# Altium schematic sheet STM32.SchDoc
size A4
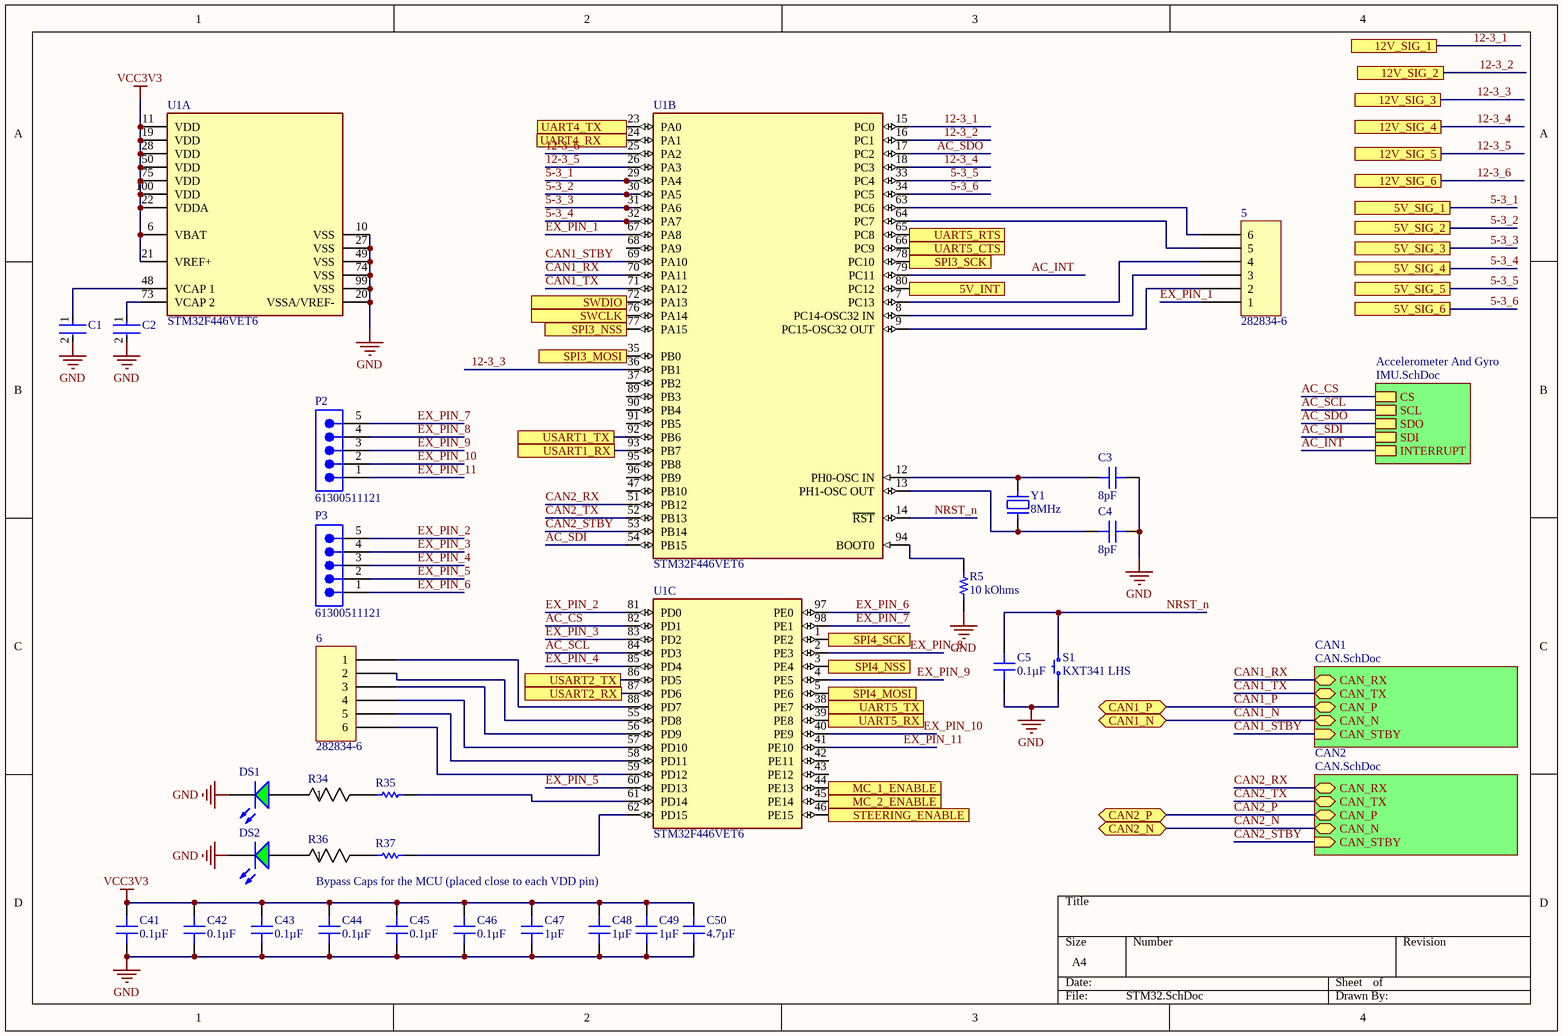
[diagram p0: STM32.SchDoc]

## Parts
5  282834-6  [TE 282834-6]
6  282834-6  [TE 282834-6]
C1  GRM188R71A225KE15D  [FP-GRM188-0_1-e0_2_0_5-MFG]  (value not drawn)
C2  GRM188R71A225KE15D  [FP-GRM188-0_1-e0_2_0_5-MFG]  (value not drawn)
C3  8pF  [CAP 0402_1005]
C4  8pF  [CAP 0402_1005]
C5  0.1µF  [CAP 0402_1005]
C41  0.1µF  [CAP 0402_1005]
C42  0.1µF  [CAP 0402_1005]
C43  0.1µF  [CAP 0402_1005]
C44  0.1µF  [CAP 0402_1005]
C45  0.1µF  [CAP 0402_1005]
C46  0.1µF  [CAP 0402_1005]
C47  1µF  [CAP 0402_1005]
C48  1µF  [CAP 0402_1005]
C49  1µF  [CAP 0402_1005]
C50  4.7µF  [CAP 0402_1005]
DS1  HLMP-4740  [AVAG-HLMP-4740]  (value not drawn)
DS2  HLMP-4740  [AVAG-HLMP-4740]  (value not drawn)
P2  61300511121  [61300511121]
P3  61300511121  [61300511121]
R5  10 kOhms  [RES 0402_1005]
R34  AC01000005000JA100  [RES_AC01_VIS]  (value not drawn)
R35  RC0805FR-071KL  [RESC2013X60X35ML10T20]  (value not drawn)
R36  AC01000005000JA100  [RES_AC01_VIS]  (value not drawn)
R37  RC0805FR-071KL  [RESC2013X60X35ML10T20]  (value not drawn)
S1  KXT341 LHS  [C&K KXT3]
U1  STM32F446VET6  [FP-LQFP100-1L-MFG]  (parts A,B,C of 3)
Y1  8MHz  [NDK NX3225GD]

## Sub-sheets
Accelerometer And Gyro = IMU.SchDoc: CS, SCL, SDO, SDI, INTERRUPT
CAN1 = CAN.SchDoc: CAN_RX (bidir), CAN_TX (bidir), CAN_STBY (in), CAN_P (bidir), CAN_N (bidir)
CAN2 = CAN.SchDoc: CAN_RX (bidir), CAN_TX (bidir), CAN_STBY (in), CAN_P (bidir), CAN_N (bidir)

## Ports
5V_INT, 5V_SIG_1, 5V_SIG_2, 5V_SIG_3, 5V_SIG_4, 5V_SIG_5, 5V_SIG_6, 12V_SIG_1, 12V_SIG_2, 12V_SIG_3, 12V_SIG_4, 12V_SIG_5, 12V_SIG_6, CAN1_N (bidir), CAN1_P (bidir), CAN2_N (bidir), CAN2_P (bidir), MC_1_ENABLE, MC_2_ENABLE, SPI3_MOSI, SPI3_NSS, SPI3_SCK, SPI4_MOSI, SPI4_NSS, SPI4_SCK, STEERING_ENABLE, SWCLK, SWDIO, UART4_RX, UART4_TX, UART5_CTS, UART5_RTS, UART5_RX, UART5_TX, USART1_RX, USART1_TX, USART2_RX, USART2_TX

## Nets
GND: C1.2 C2.2 C3.2 C4.2 C5.1 C41.1 C42.1 C43.1 C44.1 C45.1 C46.1 C47.1 C48.1 C49.1 C50.1 DS1.2(K) DS2.2(K) R5.1 S1.1 U1.10(VSS) U1.20(VSSA/VREF-) U1.27(VSS) U1.49(VSS) U1.74(VSS) U1.99(VSS)
VCC3V3: C41.2 C42.2 C43.2 C44.2 C45.2 C46.2 C47.2 C48.2 C49.2 C50.2 U1.6(VBAT) U1.11(VDD) U1.19(VDD) U1.21(VREF+) U1.22(VDDA) U1.28(VDD) U1.50(VDD) U1.75(VDD) U1.100(VDD)
5-3_1: U1.29(PA4) ; port 5V_SIG_1
5-3_2: U1.30(PA5) ; port 5V_SIG_2
5-3_3: U1.31(PA6) ; port 5V_SIG_3
5-3_4: U1.32(PA7) ; port 5V_SIG_4
5-3_5: U1.33(PC4) ; port 5V_SIG_5
5-3_6: U1.34(PC5) ; port 5V_SIG_6
5V_INT: U1.80(PC12) ; port 5V_INT
12-3_1: U1.15(PC0) ; port 12V_SIG_1
12-3_2: U1.16(PC1) ; port 12V_SIG_2
12-3_3: U1.36(PB1) ; port 12V_SIG_3
12-3_4: U1.18(PC3) ; port 12V_SIG_4
12-3_5: U1.26(PA3) ; port 12V_SIG_5
12-3_6: U1.25(PA2) ; port 12V_SIG_6
AC_CS: U1.82(PD1) ; sheet Accelerometer And Gyro/CS
AC_INT: U1.79(PC11) ; sheet Accelerometer And Gyro/INTERRUPT
AC_SCL: U1.84(PD3) ; sheet Accelerometer And Gyro/SCL
AC_SDI: U1.54(PB15) ; sheet Accelerometer And Gyro/SDI
AC_SDO: U1.17(PC2) ; sheet Accelerometer And Gyro/SDO
CAN1_N: port CAN1_N, sheet CAN1/CAN_N
CAN1_P: port CAN1_P, sheet CAN1/CAN_P
CAN1_RX: U1.70(PA11) ; sheet CAN1/CAN_RX
CAN1_STBY: U1.69(PA10) ; sheet CAN1/CAN_STBY
CAN1_TX: U1.71(PA12) ; sheet CAN1/CAN_TX
CAN2_N: port CAN2_N, sheet CAN2/CAN_N
CAN2_P: port CAN2_P, sheet CAN2/CAN_P
CAN2_RX: U1.51(PB12) ; sheet CAN2/CAN_RX
CAN2_STBY: U1.53(PB14) ; sheet CAN2/CAN_STBY
CAN2_TX: U1.52(PB13) ; sheet CAN2/CAN_TX
EX_PIN_1: 5.1 U1.67(PA8)
EX_PIN_2: P3.5 U1.81(PD0)
EX_PIN_3: P3.4 U1.83(PD2)
EX_PIN_4: P3.3 U1.85(PD4)
EX_PIN_5: P3.2 U1.60(PD13)
EX_PIN_6: P3.1 U1.97(PE0)
EX_PIN_7: P2.5 U1.98(PE1)
EX_PIN_8: P2.4 U1.2(PE3)
EX_PIN_9: P2.3 U1.4(PE5)
EX_PIN_10: P2.2 U1.40(PE9)
EX_PIN_11: P2.1 U1.41(PE10)
MC_1_ENABLE: U1.44(PE13) ; port MC_1_ENABLE
MC_2_ENABLE: U1.45(PE14) ; port MC_2_ENABLE
NRST_n: C5.2 S1.2 U1.14(~{RST})
SPI3_MOSI: U1.35(PB0) ; port SPI3_MOSI
SPI3_NSS: U1.77(PA15) ; port SPI3_NSS
SPI3_SCK: U1.78(PC10) ; port SPI3_SCK
SPI4_MOSI: U1.5(PE6) ; port SPI4_MOSI
SPI4_NSS: U1.3(PE4) ; port SPI4_NSS
SPI4_SCK: U1.1(PE2) ; port SPI4_SCK
STEERING_ENABLE: U1.46(PE15) ; port STEERING_ENABLE
SWCLK: U1.76(PA14) ; port SWCLK
SWDIO: U1.72(PA13) ; port SWDIO
UART4_RX: U1.24(PA1) ; port UART4_RX
UART4_TX: U1.23(PA0) ; port UART4_TX
UART5_CTS: U1.66(PC9) ; port UART5_CTS
UART5_RTS: U1.65(PC8) ; port UART5_RTS
UART5_RX: U1.39(PE8) ; port UART5_RX
UART5_TX: U1.38(PE7) ; port UART5_TX
USART1_RX: U1.93(PB7) ; port USART1_RX
USART1_TX: U1.92(PB6) ; port USART1_TX
USART2_RX: U1.87(PD6) ; port USART2_RX
USART2_TX: U1.86(PD5) ; port USART2_TX
Net5_2: 5.2 U1.9(PC15-OSC32_OUT)
Net5_3: 5.3 U1.8(PC14-OSC32_IN)
Net5_4: 5.4 U1.7(PC13)
Net5_5: 5.5 U1.64(PC7)
Net5_6: 5.6 U1.63(PC6)
Net6_1: 6.1 U1.88(PD7)
Net6_2: 6.2 U1.55(PD8)
Net6_3: 6.3 U1.56(PD9)
Net6_4: 6.4 U1.57(PD10)
Net6_5: 6.5 U1.58(PD11)
Net6_6: 6.6 U1.59(PD12)
NetC1_1: C1.1 U1.48(VCAP_1)
NetC2_1: C2.1 U1.73(VCAP_2)
NetC3_1: C3.1 U1.12(PH0-OSC_IN) Y1.2
NetC4_1: C4.1 U1.13(PH1-OSC_OUT) Y1.1
NetDS1_1: DS1.1(A) R34.1
NetDS2_1: DS2.1(A) R36.1
NetR5_2: R5.2 U1.94(BOOT0)
NetR34_2: R34.2 R35.1
NetR35_2: R35.2 U1.61(PD14)
NetR36_2: R36.2 R37.1
NetR37_2: R37.2 U1.62(PD15)

Not connected (* = marked no-connect by the designer): U1 37(PB2) 42(PE11) 43(PE12) 47(PB10) 68(PA9) 89(PB3) 90(PB4) 91(PB5) 95(PB8) 96(PB9)

## Notes on the sheet
- Bypass Caps for the MCU (placed close to each VDD pin)

## Library data of the parts
5 6 = 282834-6: TERM BLK 6P SIDE ENT 2.54MM PCB; Manufacturer: TE Connectivity AMP Connectors; Current: 10A; Mating Orientation: Horizontal with Board; Number of Levels: 1; Pitch: 0.100" (2.54mm); Positions Per Level: 6; Voltage: 150V; Wire Gauge: 16-30 AWG; Wire Termination: Screw - Rising Cage Clamp; Part Number: 282834-6; Color: Green; ComponentLink1Description: Datasheet; ComponentLink1URL: https://www.te.com/commerce/DocumentDelivery/DDEController?Action=srchrtrv&DocNm=282834&DocType=Customer+Drawing&DocLang=English; ComponentLink2Description: DigiKey Link; ComponentLink2URL: http://digikey.com/product-detail/en/te-connectivity-amp-connectors/282834-6/A98337-ND/1153267; LastUpdated: 2020-01-15 4:16:31 AM; Lifecycle Status: Active; Minimum Order: 1; Mounting Type: Through Hole; Packaging: Bulk; Part Status: Active; Price: 4.72; Series: Buchanan; Supplier 1: DigiKey; Supplier Part Number 1: A98337-ND
C1 C2 = CMP-2006-02836-2: Chip Multilayer Ceramic Capacitors for General Purpose, 0603, 2.2uF, X7R, 15%, 10%, 10V; Case Code (Metric): 1608; Height: 0.8mm; Packaging: Cut Tape; Voltage: 10V; Lead Free: Lead Free; Min Operating Temperature: -55°C; Voltage Rating (DC): 10V; Max Operating Temperature: 125°C; Voltage Rating: 10V; Dielectric: X7R; Depth: 0.8mm; Case Code (Imperial): 0603; Termination: SMD/SMT; Case/Package: 0603; Number of Pins: 2; REACH SVHC: No SVHC; Mount: Surface Mount; Width: 0.031inch; Material: Ceramic; Capacitance: 2.2uF; Package Quantity: 1; Weight: 7.1E-05oz; Length: 1.6mm; Thickness: 0.035inch; Tolerance: 10%
C3 C4 = C1005NP01H080D050BA: CAP CER 8PF 50V NP0 0402; Manufacturer: TDK Corporation; Temperature Coefficient: C0G, NP0; Tolerance: ±0.5pF; Part Number: C1005NP01H080D050BA; Value: 8pF; Applications: General Purpose; Capacitance: 8pF; ComponentLink1Description: Datasheet; ComponentLink1URL: https://product.tdk.com/info/en/catalog/datasheets/mlcc_commercial_hightemp_en.pdf?ref_disty=digikey; ComponentLink2Description: DigiKey Link; ComponentLink2URL: http://digikey.com/product-detail/en/tdk-corporation/C1005NP01H080D050BA/445-13781-1-ND/3955447; Device Package: 0402 (1005 Metric); Features: High Temperature; LastUpdated: 2020-09-02 1:02:24 AM; Lifecycle Status: Active; Minimum Order: 1; Mounting Type: Surface Mount, MLCC; Operating Temperature: -55°C ~ 150°C; Package / Case: 0402 (1005 Metric); Packaging: TapeAndReel; PartId: 2033; Part Status: Active; Price: 0.01; Series: C; Size / Dimension: 0.039" L x 0.020" W (1.00mm x 0.50mm); Supplier 1: DigiKey; Supplier Part Number 1: 445-13781-1-ND; Thickness (Max): 0.022" (0.55mm); Voltage - Rated: 50V
C5 C41-C46 = C0402C104K4RECAUTO: CAP CER 0402 0.1UF 16V X7R 10%; Manufacturer: KEMET; Part Number: C0402C104K4RECAUTO; Value: 0.1µF; Applications: Automotive, ESD Protection; Capacitance: 0.1µF; ComponentLink1Description: Datasheet; ComponentLink1URL: https://api.kemet.com/component-edge/download/datasheet/C0402C104K4RECAUTO.pdf; ComponentLink2Description: DigiKey Link; ComponentLink2URL: http://digikey.com/product-detail/en/kemet/C0402C104K4RECAUTO/399-17167-1-ND/8563708; Device Package: 0402 (1005 Metric); LastUpdated: 2020-09-02 1:02:25 AM; Lifecycle Status: Active; Minimum Order: 1; Mounting Type: Surface Mount, MLCC; Operating Temperature: -55°C ~ 125°C; Package / Case: 0402 (1005 Metric); Packaging: TapeAndReel; PartId: 1731; Part Status: Active; Price: 0.02; Series: ESD SMD Auto X7R; Size / Dimension: 0.039" L x 0.020" W (1.00mm x 0.50mm); Supplier 1: DigiKey; Supplier Part Number 1: 399-17167-1-ND; Temperature Coefficient: X7R; Thickness (Max): 0.022" (0.55mm); Tolerance: ±10%; Voltage - Rated: 16V; Ratings: AEC-Q200
C47-C49 = CGB2A1X5R1A105K033BC: CAP CER 1UF 10V X5R 0402; Manufacturer: TDK Corporation; Tolerance: ±10%; Part Number: CGB2A1X5R1A105K033BC; Value: 1µF; Applications: General Purpose; Capacitance: 1µF; ComponentLink1Description: Datasheet; ComponentLink1URL: https://product.tdk.com/info/en/catalog/datasheets/mlcc_commercial_lowprofile_en.pdf?ref_disty=digikey; ComponentLink2Description: DigiKey Link; ComponentLink2URL: http://digikey.com/product-detail/en/tdk-corporation/CGB2A1X5R1A105K033BC/445-13179-1-ND/3954845; Device Package: 0402 (1005 Metric); LastUpdated: 2020-09-02 1:02:25 AM; Lifecycle Status: Active; Minimum Order: 1; Mounting Type: Surface Mount, MLCC; Operating Temperature: -55°C ~ 85°C; Package / Case: 0402 (1005 Metric); Packaging: TapeAndReel; PartId: 1796; Part Status: Active; Price: 0.02; Series: CGB; Size / Dimension: 0.039" L x 0.020" W (1.00mm x 0.50mm); Supplier 1: DigiKey; Supplier Part Number 1: 445-13179-1-ND; Temperature Coefficient: X5R; Thickness (Max): 0.013" (0.33mm); Voltage - Rated: 10V; Features: Low Profile
C50 = C1005X5R1A475K050BC: CAP CER 4.7UF 10V X5R 0402; Manufacturer: TDK Corporation; Tolerance: ±10%; Part Number: C1005X5R1A475K050BC; Value: 4.7µF; Applications: General Purpose; Capacitance: 4.7µF; ComponentLink1Description: Datasheet; ComponentLink1URL: https://product.tdk.com/info/en/catalog/datasheets/mlcc_commercial_general_en.pdf?ref_disty=digikey; ComponentLink2Description: DigiKey Link; ComponentLink2URL: http://digikey.com/product-detail/en/tdk-corporation/C1005X5R1A475K050BC/445-13820-1-ND/3955486; Device Package: 0402 (1005 Metric); LastUpdated: 2020-09-02 1:02:25 AM; Lifecycle Status: Active; Minimum Order: 1; Mounting Type: Surface Mount, MLCC; Operating Temperature: -55°C ~ 85°C; Package / Case: 0402 (1005 Metric); Packaging: TapeAndReel; PartId: 1759; Part Status: Active; Price: 0.10; Series: C; Size / Dimension: 0.039" L x 0.020" W (1.00mm x 0.50mm); Supplier 1: DigiKey; Supplier Part Number 1: 445-13820-1-ND; Temperature Coefficient: X5R; Thickness (Max): 0.022" (0.55mm); Voltage - Rated: 10V; Features: Low ESL
DS1 DS2 = CMP-2000-06413-1: T-1 3/4 (5 mm) Low Current LED Lamp, Green, 1.9 V, -20 to 100 degC, 2-Pin THD, RoHS, Bulk; Manufacturer: AvagoTechnologies; Type: Uni-Color; Peak Wavelength: 565nm; Rad Hard: No; Viewing Angle: 50°; Dominant Wavelength/Color Temperature: 569nm; Number of LEDs: 1; Lens Appearance: ColoredDiffused; Lens Shape Type: Circular; Mounting Orientation: TopMount; Intensity: 2.3mcd; Datasheet Version: 07/2014; Category: LEDs; Datasheet URL: http://docs.avagotech.com/docs/AV02-1557EN; Packaging: Bulk; Pin Count: 2; Mounting Technology: ThroughHole; Package Reference: HLMP-4740; Mounting: ThroughHole; Manufacturer URL: http://www.avagotech.com/; Color: Green; Package: 2T-13/4; Package Description: 2-Pin Through Hole Device, Dia 5.845 mm, Pitch 2.54 mm
P2 P3 = CMP-1502-01068-2: NexarPartId: 32855526; Operating Supply Voltage: 250V; Number of Contacts: 5; Connector Type: Male Pin; Current Rating: 3A; Contact Resistance: 20mΩ; Pitch: 2.54mm; Gender: Male; Termination: Solder; RoHS: Compliant; Lead Pitch: 2.54mm; Contact Mating Length: 5.9944mm; Number of Positions: 5; Lead Free: Lead Free; Contact Plating: Gold; Number of Pins: 5; Min Operating Temperature: -40°C; Voltage Rating: 250V; Color: Black; Mount: Through Hole; REACH SVHC: Unknown; Packaging: Bulk; Height: 8.89mm; Number of Rows: 1; Orientation: Vertical; Contact Material: Copper; Max Operating Temperature: 105°C
R5 = CRCW040210K0DHEDP: RES SMD 10K OHM 0.5% 1/16W 0402; Manufacturer: Vishay Dale; Power (Watts): 0.063W, 1/16W; Temperature Coefficient: ±50ppm/°C; Part Number: CRCW040210K0DHEDP; Value: 10 kOhms; ComponentLink1Description: Datasheet; ComponentLink1URL: http://www.vishay.com/docs/20036/dcrcwpe3.pdf; ComponentLink2Description: DigiKey Link; ComponentLink2URL: http://digikey.com/product-detail/en/vishay-dale/CRCW040210K0DHEDP/541-10KAVCT-ND/3593906; Composition: Thick Film; Device Package: 0402 (1005 Metric); Height - Seated (Max): 0.016" (0.40mm); LastUpdated: 2020-09-02 1:08:05 AM; Lifecycle Status: Active; Minimum Order: 1; Number of Terminations: 2; Operating Temperature: -55°C ~ 155°C; Package / Case: 0402 (1005 Metric); Packaging: TapeAndReel; PartId: 5057; Part Status: Active; Price: 0.03; Resistance: 10 kOhms; Series: CRCW-P; Size / Dimension: 0.039" L x 0.020" W (1.00mm x 0.50mm); Supplier 1: DigiKey; Supplier Part Number 1: 541-10KAVCT-ND; Supplier Device Package: 0402; Tolerance: ±0.5%; Features: Automotive AEC-Q200; Ratings: AEC-Q200
R34 R36 = CMP-00030-39746512-1: AC01000005000JA100 Res Wirewound 500 Ohm 5% 1W 100ppm/°C to 180ppm/°C Conformal AXL Thru-Hole Ammo Pack; Voltage Rating (DC): 22V; Lead Diameter: 800µm; Resistance: 500Ω; Weight: 519.986953mg; Number of Pins: 2; Min Operating Temperature: -40°C; Case/Package: Axial; Schedule B: 8533210080, 8533210080; Features: Flame Retardant Coating; Power Rating: 1W; Max Power Dissipation: 1W; Packaging: Tape & Box (TB); RoHS: Compliant; REACH SVHC: Unknown; NexarPartId: 39746512; Temperature Coefficient: 180ppm/°C; Diameter: 4.3mm; Contact Plating: Tin; Radiation Hardening: No; Max Operating Temperature: 275°C; Length: 11mm; Tolerance: 5%; Composition: Wirewound; Number of Terminations: 2; Termination: Axial; Voltage Rating: 22V
R35 R37 = CMP-2100-03671-1: Chip Resistor, 1 KOhm, +/- 1%, 125 mW, -55 to 155 degC, 0805 (2012 Metric), RoHS, Tape and Reel; Manufacturer: Yageo; Temperature Coefficient: 100ppm/degreesC; Voltage Rating (DC): 150V; Max Power Dissipation: 125mW; Resistance: 1KOhm; Number of Pins: 2; Number of Terminations: 2; Datasheet URL: http://www.yageo.com/NewPortal/yageodocoutput?fileName=/pdf/R-Chip/PYu-RC_Group_51_RoHS_L_5.pdf; Length: 0.079inch; Package Description: 2-Pin Surface Mounted Device, Body 2 x 1.25 mm; Depth: 1.25mm; Height: 0.024inch; Military Standard: Not; Case/Package: 0805; Package Reference: 0805; RoHSCompliant: true; Lead Free: LeadFree; Packaging: TapeandReel; Package Quantity: 1; Datasheet Version: Rev. 5, 10/2016; Tolerance: 1%; Min Operating Temperature: -55degC; Voltage Rating: 150V; Composition: ThickFilm; Case Code (Imperial): 0805; Power Rating: 125mW; Width: 0.049inch; Case Code (Metric): 2012; Manufacturer URL: http://www.yageo.com/; Max Operating Temperature: 155degC; REACH SVHC: Unknown; Termination: SMD/SMT
S1 = KXT341 LHS: SWITCH TACTILE SPST-NO 0.02A 15V; Manufacturer: C&K; Actuator Height off PCB, Vertical: 0.60mm; Actuator Orientation: Top Actuated; Actuator Type: Standard; Contact Rating @ Voltage: 0.02A @ 15VDC; Illumination: Non-Illuminated; Operating Force: 330gf; Outline: 3.00mm x 2.00mm; Switch Function: Off-Mom; Part Number: KXT341 LHS; Circuit: SPST-NO; ComponentLink1Description: Datasheet; ComponentLink1URL: https://dznh3ojzb2azq.cloudfront.net/products/Tactile/KXT3/documents/datasheet.pdf; ComponentLink2Description: DigiKey Link; ComponentLink2URL: http://digikey.com/product-detail/en/c-k/KXT341-LHS/CKN10781CT-ND/6607324; LastUpdated: 2020-09-02 1:27:07 AM; Lifecycle Status: Active; Minimum Order: 1; Mounting Type: Surface Mount; Operating Temperature: -40°C ~ 85°C; Packaging: TapeAndReel; Part Status: Active; Price: 0.14; Series: KXT3; Supplier 1: DigiKey; Supplier Part Number 1: CKN10781CT-ND; Termination Style: SMD (SMT) Tab
U1 = CMP-12105-000075-1: IC MCU 32BIT 512KB FLASH 100LQFP; Manufacturer: STMicroelectronics; Ram Size: 128KBytes; Data Bus Width: 32bits; Max Junction Temp: +125°C; Number Of Adc Channels: 16; Max Supply Voltage: 3.6V; Nominal Supply Current: 1.4-86mA; Number Of Uart Channels: 6; Core Architecture: ARM Cortex-M4; Standoff Height: 0.05mm; Number Of A/D Converters: 3; Frequency: 180MHz; Number Of Cores: 1; Min Supply Voltage: 1.65V; Number Of Timers/Counters: 14; Number Of Usb Channels: 2; Number Of Spi Channels: 4; Interface: I2C,SPI,UART,USART,Parallel,CAN,USB,LIN,IrDA,I2S,Other; Memory Size: 512KBytes; Number Of I/Os: 81; Ambient Temperature Range High: +85°C; Mouser Description: ARM Microcontrollers - MCU High-performance and DSP with FPU, ARM Cortex-M4 MCU with 512 Kbytes Flash, 180 MHz CPU, Art Accelerator, SDRAM; Device Class L2: Embedded Processors and Controllers; Temperature Range Low: -40°C; Device Class L1: Integrated Circuits (ICs); RoHS: TRUE; Ipc Land Pattern Name: QFP50P1600X1600X160-100; Manufacturer Part Number: STM32F446VET6; Octopart: https://octopart.com/stm32f446vet6-stmicroelectronics-52642922; Package: LQFP100-1L; Automotive: No; Category: IC; ComponentLink2URL: https://www.st.com/resource/en/datasheet/stm32f446ve.pdf; Digikey Description: IC MCU 32BIT 512KB FLASH 100LQFP; Temperature Range High: +85°C; Memory Type: FLASH; Lead Free: Yes; Height: 1.6mm; ComponentLink2Description: Datasheet; Number Of I2C Channels: 4; Device Class L3: Microcontrollers; Temperature: -40°C to +85°C; Ambient Temperature Range Low: -40°C
Y1 = NX3225GD-8MHZ-STD-CRA-3: CRYSTAL 8.0000MHZ 8PF SMD; Manufacturer: NDK America, Inc.; ESR (Equivalent Series Resistance): 500 Ohms; Frequency Stability: ±150ppm; Frequency Tolerance: ±50ppm; Operating Mode: Fundamental; Part Number: NX3225GD-8MHZ-STD-CRA-3; ComponentLink1Description: Datasheet; ComponentLink1URL: http://www.ndk.com/images/products/catalog/c_NX3225GD-STD-CRA-3_e.pdf; ComponentLink2Description: DigiKey Link; ComponentLink2URL: http://digikey.com/product-detail/en/ndk-america-inc/NX3225GD-8MHZ-STD-CRA-3/644-1178-1-ND/3125567; Frequency: 8MHz; Height - Seated (Max): 0.039" (1.00mm); LastUpdated: 2020-09-02 1:25:56 AM; Lifecycle Status: Active; Load Capacitance: 8pF; Minimum Order: 1; Mounting Type: Surface Mount; Operating Temperature: -40°C ~ 150°C; Package / Case: 2-SMD, No Lead; Packaging: TapeAndReel; PartId: 744; Part Status: Active; Price: 0.48; Ratings: AEC-Q200; Series: NX3225GD; Size / Dimension: 0.126" L x 0.098" W (3.20mm x 2.50mm); Supplier 1: DigiKey; Supplier Part Number 1: 644-1178-1-ND; Type: MHz Crystal; Value: 8MHz